# EAGLE design air_node (EAGLE 9.6.2)
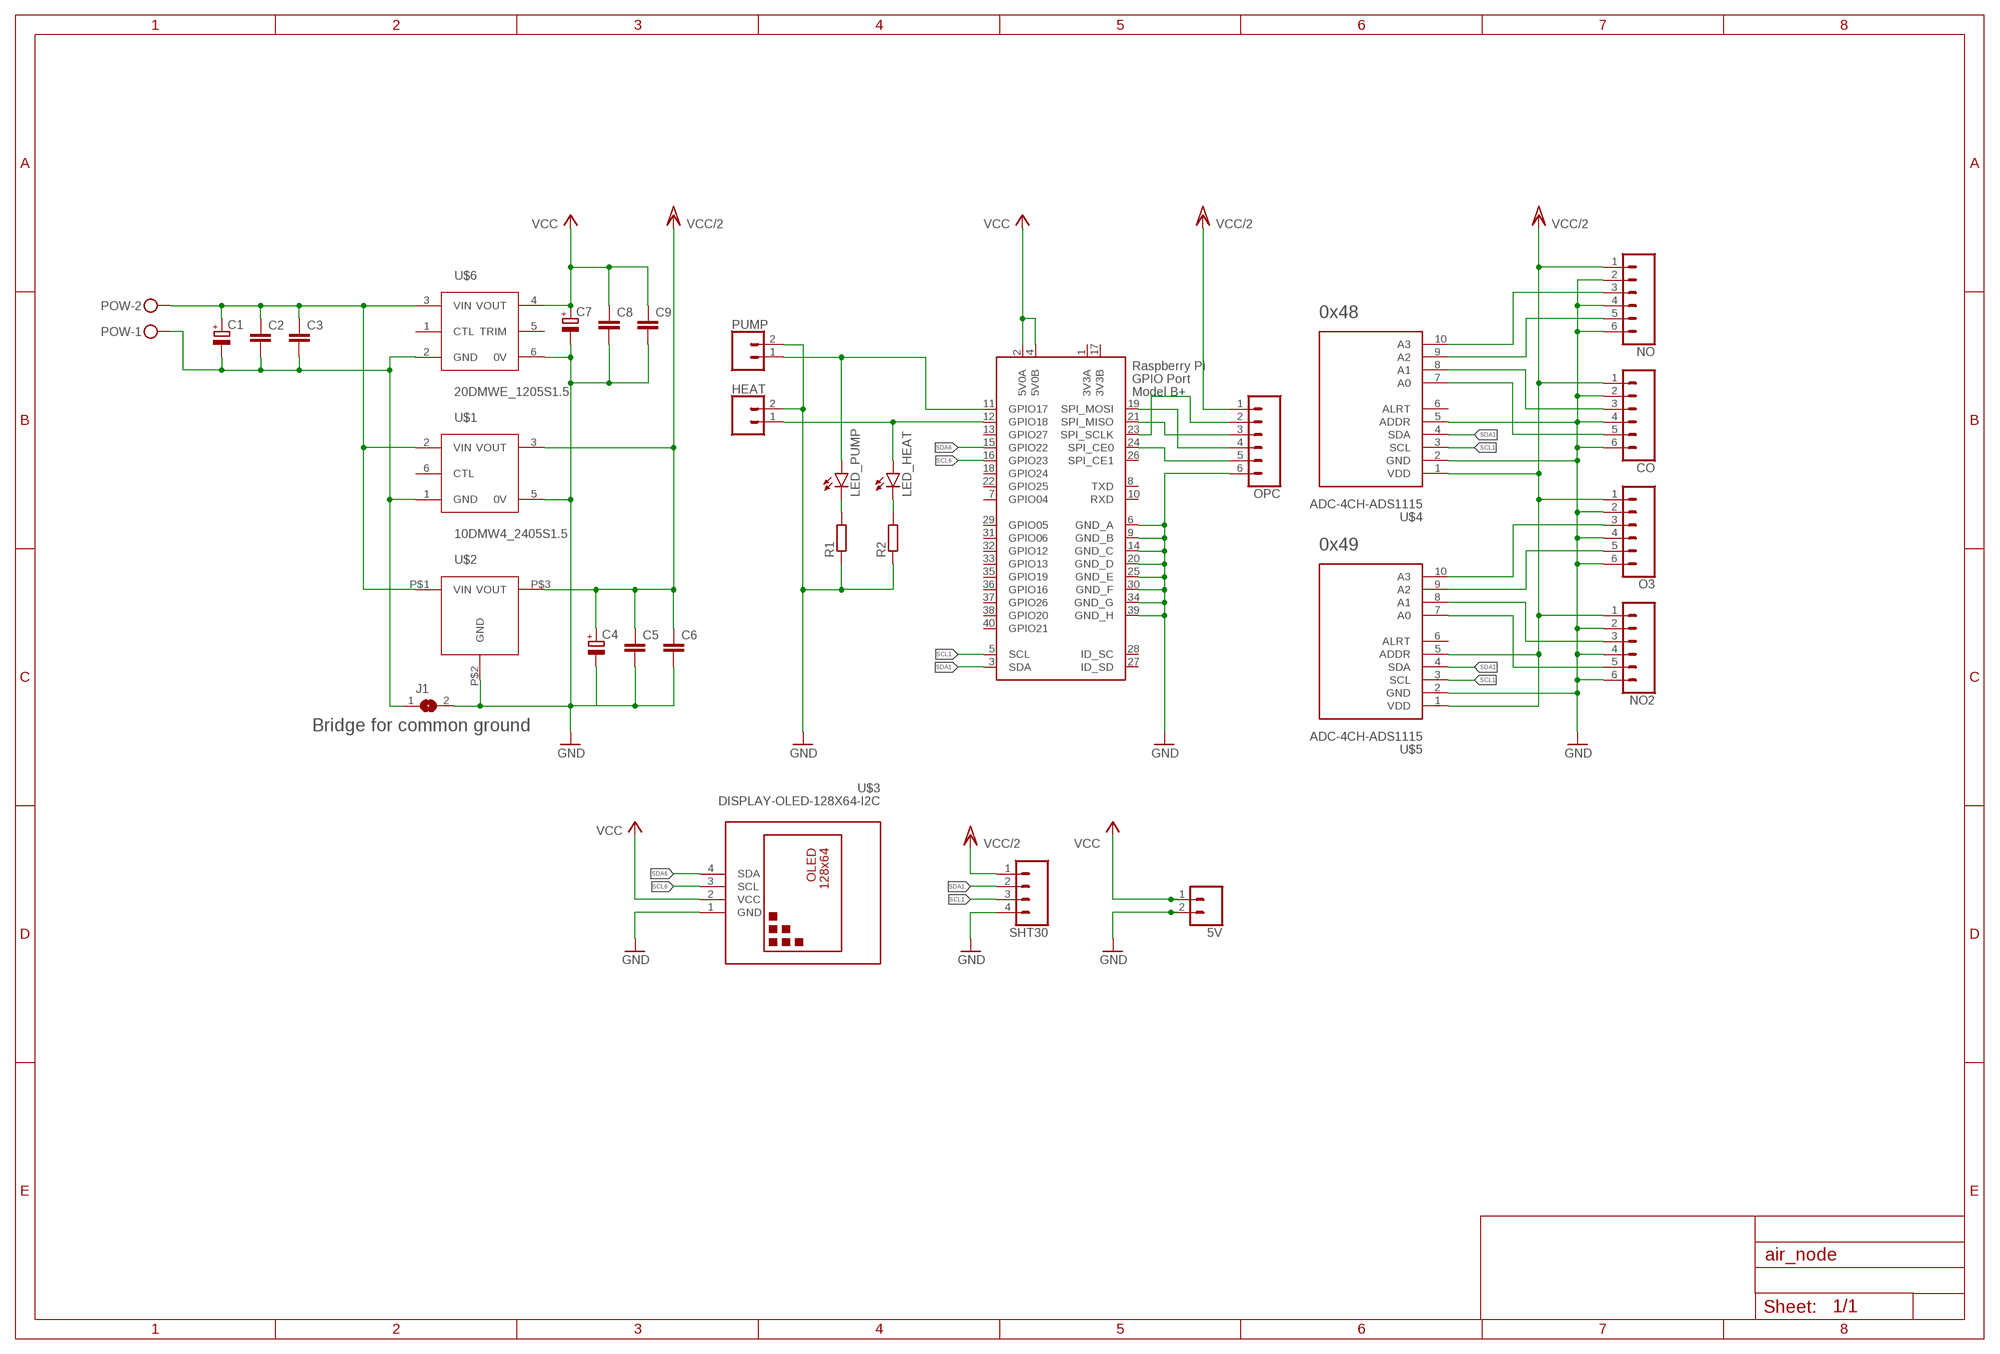
[diagram p0: schematic, sheet 1]

## Parts
5V  CONN_021X02_NO_SILK  [1X02_NO_SILK]
C1  CPOL-EUE3.5-10  [E3,5-10]
C2  C-EUC1206  [C1206]
C3  C-EUC0805  [C0805]
C4  CPOL-EUE3.5-10  [E3,5-10]
C5  C-EUC1206  [C1206]
C6  C-EUC0805  [C0805]
C7  CPOL-EUE3.5-10  [E3,5-10]
C8  C-EUC1206  [C1206]
C9  C-EUC0805  [C0805]
CO  CONN_06NO_SILK_FEMALE_PTH  [1X06_NO_SILK]
HEAT  CONN_021X02_NO_SILK  [1X02_NO_SILK]
J1  SJ  [SJ]
LED_HEAT  LEDCHIP-LED0805  [CHIP-LED0805]
LED_PUMP  LEDCHIP-LED0805  [CHIP-LED0805]
NO  CONN_06NO_SILK_FEMALE_PTH  [1X06_NO_SILK]
NO2  CONN_06NO_SILK_FEMALE_PTH  [1X06_NO_SILK]
O3  CONN_06NO_SILK_FEMALE_PTH  [1X06_NO_SILK]
OPC  CONN_06NO_SILK_FEMALE_PTH  [1X06_NO_SILK]
POW  MKDSN1,5/2-5,08  [MKDSN1,5/2-5,08]
PUMP  CONN_021X02_NO_SILK  [1X02_NO_SILK]
R1  R-EU_R0805  [R0805]
R2  R-EU_R0805  [R0805]
SHT30  CONN_041X04_NO_SILK  [1X04_NO_SILK]
U$1  10DMW4_2405S1.5  [10DMW4_2405S1.5]
U$2  LME78_05-1.0  [LME78_05-1.0]
U$3  DISPLAY-OLED-128X64-I2C  [DISPLAY-OLED-128X64-I2C]
U$4  ADC-4CH-ADS1115  [ADC-4CH-ADS1115]
U$5  ADC-4CH-ADS1115  [ADC-4CH-ADS1115]
U$6  20DMWE_1205S1.5  [20DMWE_1205S1.5]
X1  RASPI_BOARD_B+#_E4  [RASPI_BOARD_B+_EDGES_4DRILL]

## Nets
12VGND: C1.- C2.2 C3.2 J1.1 POW.1 U$1.1(GND) U$6.2(GND)
+12V: C1.+ C2.1 C3.1 POW.2 U$1.2(VIN) U$2.P$1(VIN) U$6.3(VIN)
GND: 5V.2 C4.- C5.2 C6.2 C7.- C8.2 C9.2 CO.2 CO.4 CO.6 HEAT.2 J1.2 NO2.2 NO2.4 NO2.6 NO.2 NO.4 NO.6 O3.2 O3.4 O3.6 OPC.6 PUMP.2 R1.1 R2.1 SHT30.4 U$1.5(0V) U$2.P$2(GND) U$3.1(GND) U$4.2(GND) U$4.5(ADDR) U$5.2(GND) U$6.6(0V) X1.6(GND_A) X1.9(GND_B) X1.14(GND_C) X1.20(GND_D) X1.25(GND_E) X1.30(GND_F) X1.34(GND_G) X1.39(GND_H)
N$1: HEAT.1 LED_HEAT.A X1.12(GPIO18)
N$2: LED_PUMP.A PUMP.1 X1.11(GPIO17)
N$3: OPC.2 X1.23(SPI_SCLK)
N$4: OPC.4 X1.19(SPI_MOSI)
N$5: OPC.5 X1.24(SPI_CE0)
N$6: OPC.3 X1.21(SPI_MISO)
N$7: NO.3 U$4.10(A3)
N$8: NO.5 U$4.9(A2)
N$9: CO.3 U$4.8(A1)
N$10: CO.5 U$4.7(A0)
N$11: O3.3 U$5.10(A3)
N$12: O3.5 U$5.9(A2)
N$13: NO2.3 U$5.8(A1)
N$14: NO2.5 U$5.7(A0)
N$15: LED_PUMP.C R1.2
N$16: LED_HEAT.C R2.2
SCL1: SHT30.3 U$4.3(SCL) U$5.3(SCL) X1.5(SCL)
SCL6: U$3.3(SCL) X1.16(GPIO23)
SDA1: SHT30.2 U$4.4(SDA) U$5.4(SDA) X1.3(SDA)
SDA6: U$3.4(SDA) X1.15(GPIO22)
VCC: 5V.1 C7.+ C8.1 C9.1 U$3.2(VCC) U$6.4(VOUT) X1.2(5V0A) X1.4(5V0B)
VCC/2: C4.+ C5.1 C6.1 CO.1 NO2.1 NO.1 O3.1 OPC.1 SHT30.1 U$1.3(VOUT) U$2.P$3(VOUT) U$4.1(VDD) U$5.1(VDD) U$5.5(ADDR)
Unconnected: U$1.6(CTL) U$4.6(ALRT) U$5.6(ALRT) U$6.1(CTL) U$6.5(TRIM) X1.7(GPIO04) X1.8(TXD) X1.10(RXD) X1.13(GPIO27) X1.18(GPIO24) X1.22(GPIO25) X1.26(SPI_CE1) X1.27(ID_SD) X1.28(ID_SC) X1.29(GPIO05) X1.31(GPIO06) X1.32(GPIO12) X1.33(GPIO13) X1.35(GPIO19) X1.36(GPIO16) X1.37(GPIO26) X1.38(GPIO20) X1.40(GPIO21)

## Notes on the sheet
- 0x48
- 0x49
- Bridge for common ground

## Power pins joined to a net without a drawn wire
3V3A: X1.1(3V3A)
3V3B: X1.17(3V3B)

## Library data of the parts
5V HEAT PUMP = SparkFun-Connectors:CONN_02: Multi connection point. Often used as Generic Header-pin footprint for 0.1 inch spaced/style header connections On any of the 0.1 inch spaced packages, you can populate with these: Break Away Headers - Straight <https://www.sparkfun.com/products/116> (PRT-00116) Break Away Male Headers - Right Angle <https://www.sparkfun.com/products/553> (PRT-00553) Female Headers <https://www.sparkfun.com/products/115> (PRT-00115) Break Away Headers - Machine Pin <https://www.sparkfun.com/products/117> (PRT-00117) Break Away Female Headers - Swiss Machine Pin <https://www.sparkfun.com/products/743> (PRT-00743) For SCREWTERMINALS and SPRING TERMINALS visit here: Screw Terimnals on SparkFun.com <https://www.sparkfun.com/search/results?term=Screw+Terminals> (5mm/3.5mm/2.54mm spacing) This device is also useful as a general connection point to wire up your design to another part of your project. Our various solder wires solder well into these plated through hole pads. Hook-Up Wire - Assortment (Stranded, 22 AWG) <https://www.sparkfun.com/products/11375> (PRT-11375) Hook-Up Wire - Assortment (Solid Core, 22 AWG) <https://www.sparkfun.com/products/11367> (PRT-11367) View the entire wire category on our website here <https://www.sparkfun.com/categories/141> Special notes: Molex polarized connector foot print use with: PRT-08233 with associated crimp pins and housings. 2.54_SCREWTERM for use with PRT-10571. 3.5mm Screw Terminal footprints for PRT-08084 5mm Screw Terminal footprints for use with PRT-08432
C1 C4 C7 = rcl:CPOL-EU: POLARIZED CAPACITOR, European symbol; SPICEPREFIX: C
C2 C3 C5 C6 C8 C9 = rcl:C-EU: CAPACITOR, European symbol; SPICEPREFIX: C
CO NO NO2 O3 = SparkFun-Connectors:CONN_06: Multi connection point. Often used as Generic Header-pin footprint for 0.1 inch spaced/style header connections On any of the 0.1 inch spaced packages, you can populate with these: Break Away Headers - Straight <https://www.sparkfun.com/products/116> (PRT-00116) Break Away Male Headers - Right Angle <https://www.sparkfun.com/products/553> (PRT-00553) Female Headers <https://www.sparkfun.com/products/115> (PRT-00115) Break Away Headers - Machine Pin <https://www.sparkfun.com/products/117> (PRT-00117) Break Away Female Headers - Swiss Machine Pin <https://www.sparkfun.com/products/743> (PRT-00743) Arduino Stackable Header - 6 Pin <https://www.sparkfun.com/products/9280> (PRT-09280) For SCREWTERMINALS and SPRING TERMINALS visit here: Screw Terimnals on SparkFun.com <https://www.sparkfun.com/search/results?term=Screw+Terminals> (5mm/3.5mm/2.54mm spacing) This device is also useful as a general connection point to wire up your design to another part of your project. Our various solder wires solder well into these plated through hole pads. Hook-Up Wire - Assortment (Stranded, 22 AWG) <https://www.sparkfun.com/products/11375> (PRT-11375) Hook-Up Wire - Assortment (Solid Core, 22 AWG) <https://www.sparkfun.com/products/11367> (PRT-11367) View the entire wire category on our website here <https://www.sparkfun.com/categories/141>; PROD_ID: CONN-08437
J1 = jumper:SJ: SMD solder JUMPER
LED_HEAT LED_PUMP = led:LED: LED OSRAM: - CHIPLED LG R971, LG N971, LY N971, LG Q971, LY Q971, LO R971, LY R971 LH N974, LH R974 LS Q976, LO Q976, LY Q976 LO Q996 - Hyper CHIPLED LW Q18S LB Q993, LB Q99A, LB R99A - SideLED LS A670, LO A670, LY A670, LG A670, LP A670 LB A673, LV A673, LT A673, LW A673 LH A674 LY A675 LS A676, LA A676, LO A676, LY A676, LW A676 LS A679, LY A679, LG A679 - Hyper Micro SIDELED® LS Y876, LA Y876, LO Y876, LY Y876 LT Y87S - SmartLED LW L88C, LW L88S LB L89C, LB L89S, LG L890 LS L89K, LO L89K, LY L89K LS L896, LA L896, LO L896, LY L896 - TOPLED LS T670, LO T670, LY T670, LG T670, LP T670 LSG T670, LSP T670, LSY T670, LOP T670, LYG T670 LG T671, LOG T671, LSG T671 LB T673, LV T673, LT T673, LW T673 LH T674 LS T676, LA T676, LO T676, LY T676, LB T676, LH T676, LSB T676, LW T676 LB T67C, LV T67C, LT T67C, LS T67K, LO T67K, LY T67K, LW E67C LS E67B, LA E67B, LO E67B, LY E67B, LB E67C, LV E67C, LT E67C LW T67C LS T679, LY T679, LG T679 LS T770, LO T770, LY T770, LG T770, LP T770 LB T773, LV T773, LT T773, LW T773 LH T774 LS E675, LA E675, LY E675, LS T675 LS T776, LA T776, LO T776, LY T776, LB T776 LHGB T686 LT T68C, LB T68C - Hyper Mini TOPLED® LB M676 - Mini TOPLED Santana® LG M470 LS M47K, LO M47K, LY M47K Source: http://www.osram.convergy.de LUXEON: - LUMILED® LXK2-PW12-R00, LXK2-PW12-S00, LXK2-PW14-U00, LXK2-PW14-V00 LXK2-PM12-R00, LXK2-PM12-S00, LXK2-PM14-U00 LXK2-PE12-Q00, LXK2-PE12-R00, LXK2-PE12-S00, LXK2-PE14-T00, LXK2-PE14-U00 LXK2-PB12-K00, LXK2-PB12-L00, LXK2-PB12-M00, LXK2-PB14-N00, LXK2-PB14-P00, LXK2-PB14-Q00 LXK2-PR12-L00, LXK2-PR12-M00, LXK2-PR14-Q00, LXK2-PR14-R00 LXK2-PD12-Q00, LXK2-PD12-R00, LXK2-PD12-S00 LXK2-PH12-R00, LXK2-PH12-S00 LXK2-PL12-P00, LXK2-PL12-Q00, LXK2-PL12-R00 Source: www.luxeon.com KINGBRIGHT: KA-3528ASYC Source: www.kingbright.com
OPC = SparkFun-Connectors:CONN_06: Multi connection point. Often used as Generic Header-pin footprint for 0.1 inch spaced/style header connections On any of the 0.1 inch spaced packages, you can populate with these: Break Away Headers - Straight <https://www.sparkfun.com/products/116> (PRT-00116) Break Away Male Headers - Right Angle <https://www.sparkfun.com/products/553> (PRT-00553) Female Headers <https://www.sparkfun.com/products/115> (PRT-00115) Break Away Headers - Machine Pin <https://www.sparkfun.com/products/117> (PRT-00117) Break Away Female Headers - Swiss Machine Pin <https://www.sparkfun.com/products/743> (PRT-00743) Arduino Stackable Header - 6 Pin <https://www.sparkfun.com/products/9280> (PRT-09280) For SCREWTERMINALS and SPRING TERMINALS visit here: Screw Terimnals on SparkFun.com <https://www.sparkfun.com/search/results?term=Screw+Terminals> (5mm/3.5mm/2.54mm spacing) This device is also useful as a general connection point to wire up your design to another part of your project. Our various solder wires solder well into these plated through hole pads. Hook-Up Wire - Assortment (Stranded, 22 AWG) <https://www.sparkfun.com/products/11375> (PRT-11375) Hook-Up Wire - Assortment (Solid Core, 22 AWG) <https://www.sparkfun.com/products/11367> (PRT-11367) View the entire wire category on our website here <https://www.sparkfun.com/categories/141>; PROD_ID: CONN-08437; SPICEPREFIX: X
POW = con-phoenix-508:MKDSN1,5/2-5,08: MKDSN 1,5/ 2-5,08 Printklemme Nennstrom: 13,5 A Nennspannung: 250 V Rastermaß: 5,08 mm Polzahl: 2 Anschlussart: Schraubanschluss Montage: Löten Anschlussrichtung Leiter/Platine: 0 ° Artikelnummer: 1729128 Source: http://eshop.phoenixcontact.com .. 1729128.pdf
R1 R2 = rcl:R-EU_: RESISTOR, European symbol; SPICEPREFIX: R
SHT30 = SparkFun-Connectors:CONN_04: Multi connection point. Often used as Generic Header-pin footprint for 0.1 inch spaced/style header connections On any of the 0.1 inch spaced packages, you can populate with these: Break Away Headers - Straight <https://www.sparkfun.com/products/116> (PRT-00116) Break Away Male Headers - Right Angle <https://www.sparkfun.com/products/553> (PRT-00553) Female Headers <https://www.sparkfun.com/products/115> (PRT-00115) Break Away Headers - Machine Pin <https://www.sparkfun.com/products/117> (PRT-00117) Break Away Female Headers - Swiss Machine Pin <https://www.sparkfun.com/products/743> (PRT-00743) For SCREWTERMINALS and SPRING TERMINALS visit here: Screw Terimnals on SparkFun.com <https://www.sparkfun.com/search/results?term=Screw+Terminals> (5mm/3.5mm/2.54mm spacing) This device is also useful as a general connection point to wire up your design to another part of your project. Our various solder wires solder well into these plated through hole pads. Hook-Up Wire - Assortment (Stranded, 22 AWG) <https://www.sparkfun.com/products/11375> (PRT-11375) Hook-Up Wire - Assortment (Solid Core, 22 AWG) <https://www.sparkfun.com/products/11367> (PRT-11367) View the entire wire category on our website here <https://www.sparkfun.com/categories/141> Special notes: Molex polarized connector foot print use with SKU : PRT-08231 with associated crimp pins and housings. 1MM SMD Version SKU: PRT-10208; PROD_ID: CONN-09696
U$1 = jobbel:10DMW4_2405S1.5
U$2 = jobbel:LME78_05-1.0
U$3 = diy-modules:DISPLAY-OLED-128X64-I2C: 128x64 Dot Matrix OLED Module based on SSD1306 chip Variant with I2C interface More details available here: http://www.instructables.com/id/Monochrome-096-i2c-OLED-display-with-arduino-SSD13/ SSD1306 datasheet: https://cdn-shop.adafruit.com/datasheets/SSD1306.pdf Click here to find device on ebay.com <http://www.ebay.com/sch/oled+display+128x64+iic> Note: There are two variants: I2C and SPI. Search for the proper version.
U$4 U$5 = diy-modules:ADC-4CH-ADS1115: 4 Channel 16-Bit Analog-to-Digital Converter based on ADS1115 chip Arduino ADS1115 Getting Started Tutorial is available here: http://henrysbench.capnfatz.com/henrys-bench/arduino-voltage-measurements/arduino-ads1115-module-getting-started-tutorial/ ADS1115 datasheet is available here: http://www.ti.com/lit/ds/symlink/ads1115.pdf Click here to find device on ebay.com <http://www.ebay.com/sch/ads1115+module>
U$6 = jobbel:20DMWE_1205S1.5
X1 = raspberrypi_bastelstube_v13:RASPI_BOARD_B+#: Raspberry Pi GPIO connector with markings for the outer dimensions of the Raspberry Pi board model B+ with different sets of drill holes or mounting pads All pins connected

## Board
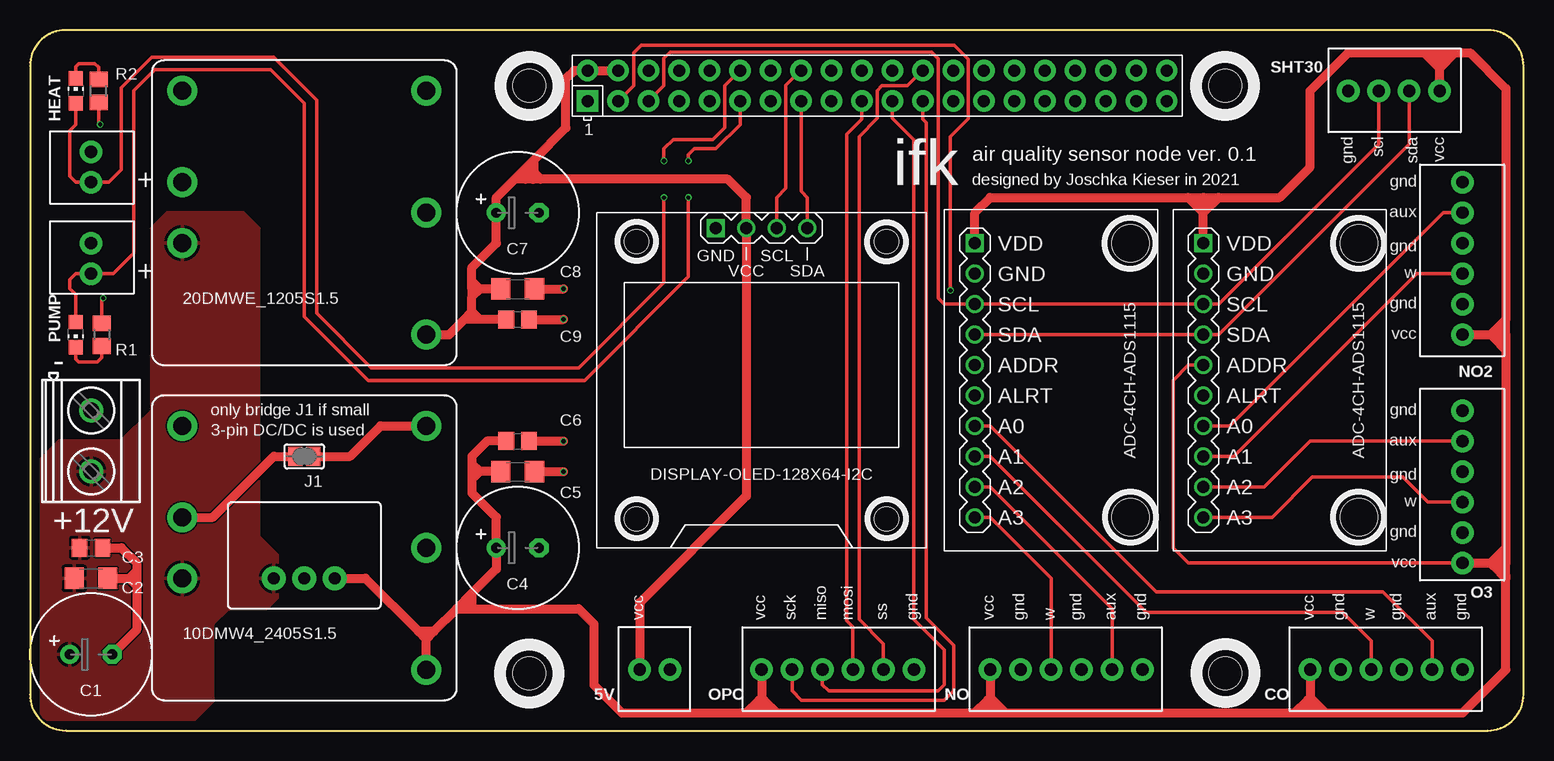
[diagram p1: board, top side]
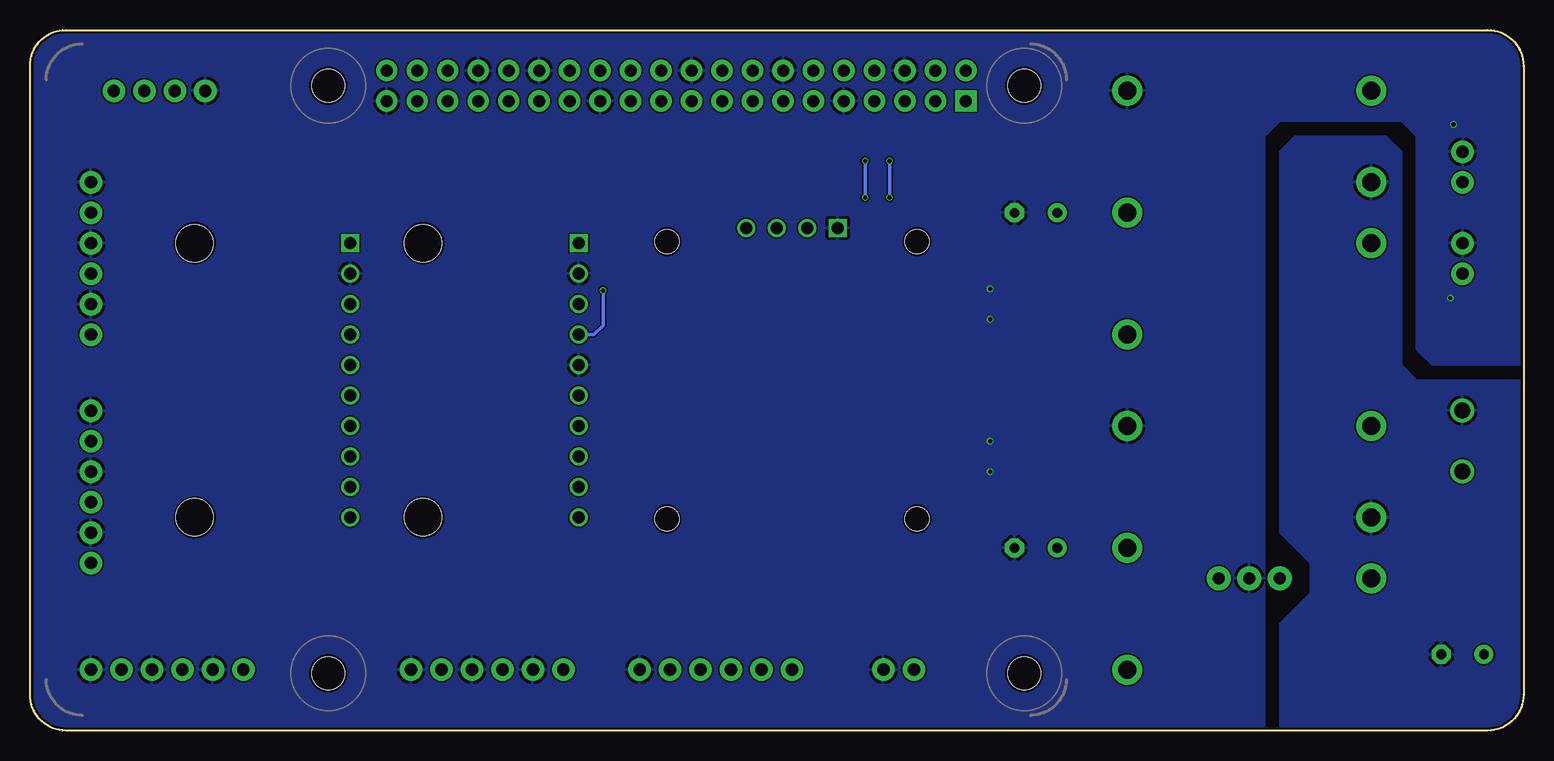
[diagram p2: board, bottom side, seen from below]

Size 124.46 x 58.42 mm. Coordinates in mm from the lower left corner, seen from the top.
Outline: 0,55.42 0,3 arc90 3,0 121.46,0 arc90 124.46,3 124.46,55.42 arc90 121.46,58.42 3,58.42 arc90 0,55.42
Copper layers (1*16): Top 0.035559375mm / dielectric 1.6mm / Bottom 0.035559375mm
Design rules "jlcpcb2layer *": minimum track width 5mil, minimum drill 12mil, track to track 5mil, track to pad 5mil, pad to pad 5mil, via to via 5mil, smd to smd 5mil, copper to edge 8mil, drill to drill 6mil, minimum pad ring 5mil, minimum via ring 3mil, stop-mask expansion 2.5mil, vias tented up to drill 15mil, thermal gap 10mil

### Footprints (pad centres in the part's own frame; a part is rotated, then mirrored left to right if it is on the bottom)
1X02_NO_SILK = drill 1.016 pad 1.88: 1 0,0; 2 2.54,0
E3,5-10 = drill 0.813 pad 1.6: + -1.778,0 | drill 0.813 pad 1.6 octagon: - 1.778,0
C1206 = smd 1.6 x 1.8: 1 -1.4,0; 2 1.4,0
C0805 = smd 1.3 x 1.5: 1 -0.95,0; 2 0.95,0
1X06_NO_SILK = drill 1.016 pad 1.88: 1 0,0; 2 2.54,0; 3 5.08,0; 4 7.62,0; 5 10.16,0; 6 12.7,0
SJ = smd 1.168 x 1.6: 1 -0.762,0; 2 0.762,0
CHIP-LED0805 = smd 1.2 x 1.2: A 0,-1.05; C 0,1.05
MKDSN1,5/2-5,08 = drill 1.3 pad 2: 1 -2.561,0.025; 2 2.519,0.025
R0805 = smd 1.3 x 1.5: 1 -0.95,0; 2 0.95,0
1X04_NO_SILK = drill 1.016 pad 1.88: 1 0,0; 2 2.54,0; 3 5.08,0; 4 7.62,0
10DMW4_2405S1.5 = drill 1.5 pad 2.5: 1 -10.16,2.54; 2 -10.16,-2.54; 3 10.16,-10.16; 4 10.16,0; 5 10.16,10.16; 6 -10.16,10.16
LME78_05-1.0 = drill 1 pad 2: P$1 -2.54,-2.54; P$2 0,-2.54; P$3 2.54,-2.54
DISPLAY-OLED-128X64-I2C = drill 1 square: 1 -3.81,12.7 | drill 1: 2 -1.27,12.7; 3 1.27,12.7; 4 3.81,12.7 | hole 2: -10.414,11.557; 10.414,11.557; 10.414,-11.557; -10.414,-11.557
ADC-4CH-ADS1115 = drill 1 square: 1 -6.35,11.43 | drill 1: 2 -6.35,8.89; 3 -6.35,6.35; 4 -6.35,3.81; 5 -6.35,1.27; 6 -6.35,-1.27; 7 -6.35,-3.81; 8 -6.35,-6.35; 9 -6.35,-8.89; 10 -6.35,-11.43 | hole 3.1: 6.604,11.43; 6.604,-11.43
20DMWE_1205S1.5 = drill 1.5 pad 2.5: 1 -10.16,10.16; 2 -10.16,2.54; 3 -10.16,-2.54; 4 10.16,-10.16; 5 10.16,0; 6 10.16,10.16
RASPI_BOARD_B+_EDGES_4DRILL = drill 1 pad 1.778 square: 1 8.37,51.23 | drill 1 pad 1.778: 2 8.37,53.77; 3 10.91,51.23; 4 10.91,53.77; 5 13.45,51.23; 6 13.45,53.77; 7 15.99,51.23; 8 15.99,53.77; 9 18.53,51.23; 10 18.53,53.77; 11 21.07,51.23; 12 21.07,53.77; 13 23.61,51.23; 14 23.61,53.77; 15 26.15,51.23; 16 26.15,53.77; 17 28.69,51.23; 18 28.69,53.77; 19 31.23,51.23; 20 31.23,53.77; 21 33.77,51.23; 22 33.77,53.77; 23 36.31,51.23; 24 36.31,53.77; 25 38.85,51.23; 26 38.85,53.77; 27 41.39,51.23; 28 41.39,53.77; 29 43.93,51.23; 30 43.93,53.77; 31 46.47,51.23; 32 46.47,53.77; 33 49.01,51.23; 34 49.01,53.77; 35 51.55,51.23; 36 51.55,53.77; 37 54.09,51.23; 38 54.09,53.77; 39 56.63,51.23; 40 56.63,53.77 | hole 2.75: 3.5,3.5; 3.5,52.5; 61.5,3.5; 61.5,52.5

### Placement (x,y rotation side)
5V  50.8,5.08 0 top
C1  5.08,6.35 0 top
C2  5.08,12.7 0 top
C3  5.08,15.24 0 top
C4  40.64,15.24 0 top
C5  40.64,21.59 0 top
C6  40.64,24.13 0 top
C7  40.64,43.18 0 top
C8  40.64,36.83 0 top
C9  40.64,34.29 0 top
CO  106.68,5.08 0 top
HEAT  5.08,45.72 90 top
J1  22.86,22.86 0 top
LED_HEAT  3.81,53.34 0 top
LED_PUMP  3.81,33.02 180 top
NO  80.01,5.08 0 top
NO2  119.38,33.02 90 top
O3  119.38,13.97 90 top
OPC  60.96,5.08 0 top
POW  5.08,24.13 270 top
PUMP  5.08,38.1 90 top
R1  5.97,33.02 270 top
R2  5.72,53.34 90 top
SHT30  117.47,53.34 180 top
U$1  22.86,15.24 0 top
U$2  22.86,15.24 0 top
U$3  60.96,29.21 0 top
U$4  85.09,29.21 0 top
U$5  104.14,29.21 0 top
U$6  22.86,43.18 0 top
X1  38.1,1.27 0 top

### Tracks (layer width: path | path; a pad name or v marks a point on that pad's centre or on a via)
12VGND
  Top 0.762: U$1.1 15.24,17.78 20.32,22.86 J1.1 | C2.2 8.26,12.7 | 8.89,12.7 8.26,12.7 | 8.89,12.7 8.89,12.06 | 8.89,12.06 8.89,8.38 C1.- | C3.2 7.62,15.24 8.89,13.97 8.89,13.33 | 8.89,13.33 8.89,12.7 | 8.26,12.7 8.89,13.33 | 8.26,12.7 8.89,12.06
  pour Bottom: -1.27,29.21 8.89,29.21 10.16,30.48 10.16,48.26 11.43,49.53 19.05,49.53 20.32,48.26 20.32,16.51 17.78,13.97 17.78,11.43 20.32,8.89 20.32,-1.27 -1.27,-1.27
+12V
  pour Top: 0.95,0.95 0.95,22.63 2.45,24.13 7.62,24.13 10.16,26.67 10.16,41.91 11.43,43.18 17.78,43.18 19.05,41.91 19.05,16.19 20.6,14.64 20.6,11.07 19.69,10.16 16.51,10.16 15.24,8.89 15.24,2.45 13.74,0.95
GND  (via drill 0.35)
  Top 0.3: R2.1 5.72,50.67 v5.84,50.55 | R1.1 5.97,35.94 v6.1,36.07
  Top 0.762: U$1.5 29.21,25.4 26.67,22.86 J1.2 | C8.2 v44.45,36.83 | C9.2 v44.45,34.29 | C5.2 v44.45,21.59 | C6.2 v44.45,24.13
  pour Bottom: 21.59,-1.27 125.73,-1.27 125.73,59.69 -1.27,59.69 -1.27,30.48 7.62,30.48 8.89,31.75 8.89,49.53 10.16,50.8 20.32,50.8 21.59,49.53
N$1  (via drill 0.35)
  Top 0.3: X1.12 57.91,53.78 57.91,50.29 56.9,49.28 53.59,49.28 52.83,48.51 v52.83,47.5 | v52.83,44.45 52.83,37.34 45.72,30.23 28.45,30.23 23.88,34.8 23.88,52.58 20.32,56.13 10.16,56.13 7.62,53.59 7.62,46.79 6.55,45.72 HEAT.1 3.81,45.72 3.3,46.23 3.3,50 3.81,50.51 LED_HEAT.A
  Bottom 0.3: v52.83,47.5 v52.83,44.45
N$2  (via drill 0.35)
  Top 0.3: X1.11 59.17,50.53 57.15,48.51 55.37,48.51 54.86,48.01 v54.86,47.5 | v54.86,44.45 54.86,37.85 46.23,29.21 28.19,29.21 22.86,34.54 22.86,52.32 20.07,55.12 10.41,55.12 8.64,53.34 8.64,39.81 6.93,38.1 PUMP.1 3.81,38.1 3.3,37.59 3.3,36.86 3.81,36.36 LED_PUMP.A
  Bottom 0.3: v54.86,47.5 v54.86,44.45
N$3
  Top 0.3: X1.23 74.41,50.98 74.68,50.71 74.68,9.4 76.96,7.11 76.96,3.3 76.2,2.54 64.26,2.54 63.5,3.3 OPC.2
N$4
  Top 0.3: OPC.4 68.58,8.64 68.07,9.14 68.07,49.72 69.33,50.98 X1.19
N$5
  Top 0.3: X1.24 73.12,53.76 71,53.76 70.62,53.38 70.62,51.06 69.09,49.53 69.09,9.26 71.12,7.22 OPC.5
N$6
  Top 0.3: X1.21 71.87,51.07 73.66,49.28 73.66,9.27 76.2,6.73 76.2,3.81 75.69,3.3 66.55,3.3 66.04,3.81 OPC.3
N$7
  Top 0.3: U$4.10 80.01,17.78 85.09,12.7 NO.3
N$8
  Top 0.3: U$4.9 80.01,20.32 90.17,10.16 NO.5
N$9
  Top 0.3: U$4.8 80.01,22.86 93.02,9.85 109.38,9.85 111.76,7.47 CO.3
N$10
  Top 0.3: U$4.7 80.01,25.4 93.84,11.57 112.74,11.57 116.84,7.47 CO.5
N$11
  Top 0.3: O3.3 116.49,19.05 114.41,21.13 106.86,21.13 103.5,17.78 U$5.10
N$12
  Top 0.3: U$5.9 102.88,20.32 106.69,24.13 O3.5
N$13
  Top 0.3: U$5.8 100.33,22.86 115.57,38.1 NO2.3
N$14
  Top 0.3: U$5.7 99.98,25.4 117.76,43.18 NO2.5
N$15
  Top 0.3: LED_PUMP.C 3.81,30.99 4.06,30.73 5.59,30.73 5.97,31.11 R1.2
N$16
  Top 0.3: LED_HEAT.C 3.81,55.37 4.06,55.63 5.4,55.63 5.72,55.31 R2.2
SCL1
  Top 0.3: X1.5 52.83,53.78 52.83,56.07 53.34,56.58 75.13,56.58 75.69,56.01 75.69,36.07 76.2,35.56 U$4.3 U$5.3 99.06,35.56 112.4,48.9 SHT30.3
SCL6
  Top 0.3: X1.16 64.22,55.04 63,53.82 63,45.22 62.23,44.45 U$3.3
SDA1  (via drill 0.35)
  Top 0.3: X1.3 50.29,53.78 50.29,56.52 50.93,57.15 77.03,57.15 78.2,55.98 78.2,51.03 76.71,49.53 v76.71,36.7 | U$4.4 U$5.4 99.06,33.02 114.94,48.9 SHT30.2
  Bottom 0.3: v76.71,36.7 76.71,33.78 77.47,33.02 U$4.4
SDA6
  Top 0.3: X1.15 64.25,44.97 64.77,44.45 U$3.4
VCC
  Top 0.762: C8.1 37.47,36.83 | 36.83,36.83 37.47,36.83 | 36.83,36.83 36.83,37.47 | 36.83,37.47 36.83,38.61 38.86,40.64 C7.+ 38.86,44.45 40.39,45.97 | 36.83,36.83 36.83,36.2 | U$6.4 34.93,33.02 36.2,34.29 | X1.4 X1.2 45.34,55.04 44.67,54.37 44.67,50.26 41.97,47.56 | 37.47,36.83 36.83,37.47 | 37.47,36.83 36.83,36.2 | 36.2,34.29 36.83,34.93 | 36.83,34.93 36.83,36.2 | 36.83,34.93 37.47,34.29 | C9.1 37.47,34.29 | 37.47,34.29 36.2,34.29 | 42.55,45.97 58.17,45.97 59.69,44.45 U$3.2 59.69,19.56 50.8,10.67 5V.1 | 42.55,45.97 41.91,45.97 | 41.91,45.97 41.27,45.97 | 41.27,45.97 40.39,45.97 | 40.39,45.97 41.91,47.5 | 41.97,47.56 41.97,46.67 | 41.97,46.67 41.27,45.97 | 41.97,47.56 41.91,47.5 | 41.91,47.5 41.91,45.97 | 41.97,46.67 41.97,46.55 42.55,45.97
VCC/2
  Top 0.3: U$5.5 96.52,30.48 95.25,29.21 95.25,15.24 96.52,13.97 O3.1
  Top 0.762: 33.02,7.62 32.39,8.26 | 32.39,8.26 27.94,12.7 U$2.P$3 | U$1.3 33.02,7.62 | 36.83,11.43 38.86,13.46 C4.+ 38.86,17.78 36.83,19.81 36.83,20.95 | 36.83,11.43 35.56,10.16 | C5.1 37.47,21.59 | 37.47,21.59 36.83,21.59 | 36.83,21.59 36.83,20.95 | C6.1 38.1,24.13 36.83,22.86 36.83,22.22 | 36.83,22.22 36.83,21.59 | 33.02,7.62 33.66,8.26 | 33.66,8.26 35.56,10.16 | 59.69,1.47 49.33,1.47 46.99,3.81 46.99,5.08 46.99,6.35 46.99,8.89 45.72,10.16 36.83,10.16 | 59.69,1.47 60.96,1.47 | 60.96,1.47 62.23,1.47 | 62.23,1.47 78.74,1.47 | 78.74,1.47 78.94,1.47 | 78.94,1.47 80.01,1.47 | 80.01,1.47 81.28,1.47 | 81.28,1.47 105.41,1.47 | 105.41,1.47 105.61,1.47 | 105.61,1.47 106.68,1.47 | 106.68,1.47 107.95,1.47 | 107.95,1.47 119.38,1.47 122.99,5.08 122.99,12.7 | 122.99,12.7 122.99,12.9 | 122.99,12.9 122.99,13.97 | NO2.1 121.92,33.02 | 122.99,33.02 121.92,33.02 | 35.56,10.16 36.83,10.16 | OPC.1 60.96,2.54 | 60.96,2.54 60.96,1.47 | NO.1 80.01,2.54 | 80.01,1.47 80.01,2.54 | CO.1 106.68,2.54 | 106.68,1.47 106.68,2.54 | O3.1 121.92,13.97 | 122.99,13.97 121.92,13.97 | 122.99,33.02 122.99,34.29 | 122.99,33.02 122.99,31.95 | 122.99,31.95 122.99,31.75 | 122.99,31.75 122.99,15.24 | 122.99,15.24 122.99,13.97 | 36.83,11.43 36.83,10.16 | 60.96,2.54 61.16,2.54 62.23,1.47 | 60.96,2.54 60.76,2.54 59.69,1.47 | 80.01,2.54 78.94,1.47 | 80.01,2.54 80.21,2.54 81.28,1.47 | 80.01,2.54 79.81,2.54 78.74,1.47 | 106.68,2.54 105.61,1.47 | 106.68,2.54 106.88,2.54 107.95,1.47 | 106.68,2.54 106.48,2.54 105.41,1.47 | 121.92,13.97 122.99,12.9 | 121.92,13.97 121.92,14.17 122.99,15.24 | 121.92,13.97 121.92,13.77 122.99,12.7 | 121.92,33.02 122.99,31.95 | 121.92,33.02 121.92,33.22 122.99,34.29 | 121.92,33.02 121.92,32.82 122.99,31.75
  Top 0.762: U$4.1 78.74,43.18 80.01,44.45 96.52,44.45 | 96.52,44.45 97.79,44.45 | 97.79,44.45 99.06,44.45 | 99.06,44.45 104.14,44.45 106.68,46.99 106.68,53.34 109.85,56.52 116.21,56.52 | U$5.1 97.79,43.18 | 97.79,44.45 97.79,43.18 | 99.06,44.45 97.79,43.18 | 97.79,43.18 96.52,44.45 | 116.21,56.52 116.84,56.52 | 116.84,56.52 117.47,56.52 | 117.47,56.52 118.11,56.52 | 118.11,56.52 118.75,56.52 | 118.75,56.52 120.02,56.52 122.99,53.54 122.99,34.29 | SHT30.1 117.47,55.25 | 117.47,55.88 117.47,55.25 | 117.47,56.52 117.47,55.88 | 117.47,55.88 118.11,56.52 | 117.47,55.88 116.84,56.52 | 117.47,55.25 118.75,56.52 | 117.47,55.25 116.21,56.52 | 37.47,21.59 36.83,20.95 | 37.47,21.59 36.83,22.22 | 33.66,8.26 32.39,8.26

### Text on the board
tNames: gnd | scl | sda | vcc | air quality sensor node ver. 0.1 | gnd | + | ifk | designed by Joschka Kieser in 2021 | aux | gnd | w | + | gnd | vcc | - | gnd | only bridge J1 if small | 3-pin DC/DC is used | aux | gnd | w | gnd | +12V | vcc | vcc | vcc | sck | miso | mosi | ss | gnd | vcc | gnd | w | gnd | aux | gnd | vcc | gnd | w | gnd | aux | gnd